# Altium schematic sheet S7CAS-PLEIADES-CARTE-MERE_P02_MOTOR_CTRL.SchDoc
size Tabloid; DocumentNumber: 9; SheetNumber: 9; SheetTotal: 14; Size: 11x17; Sheet_Name: Control du Moteur
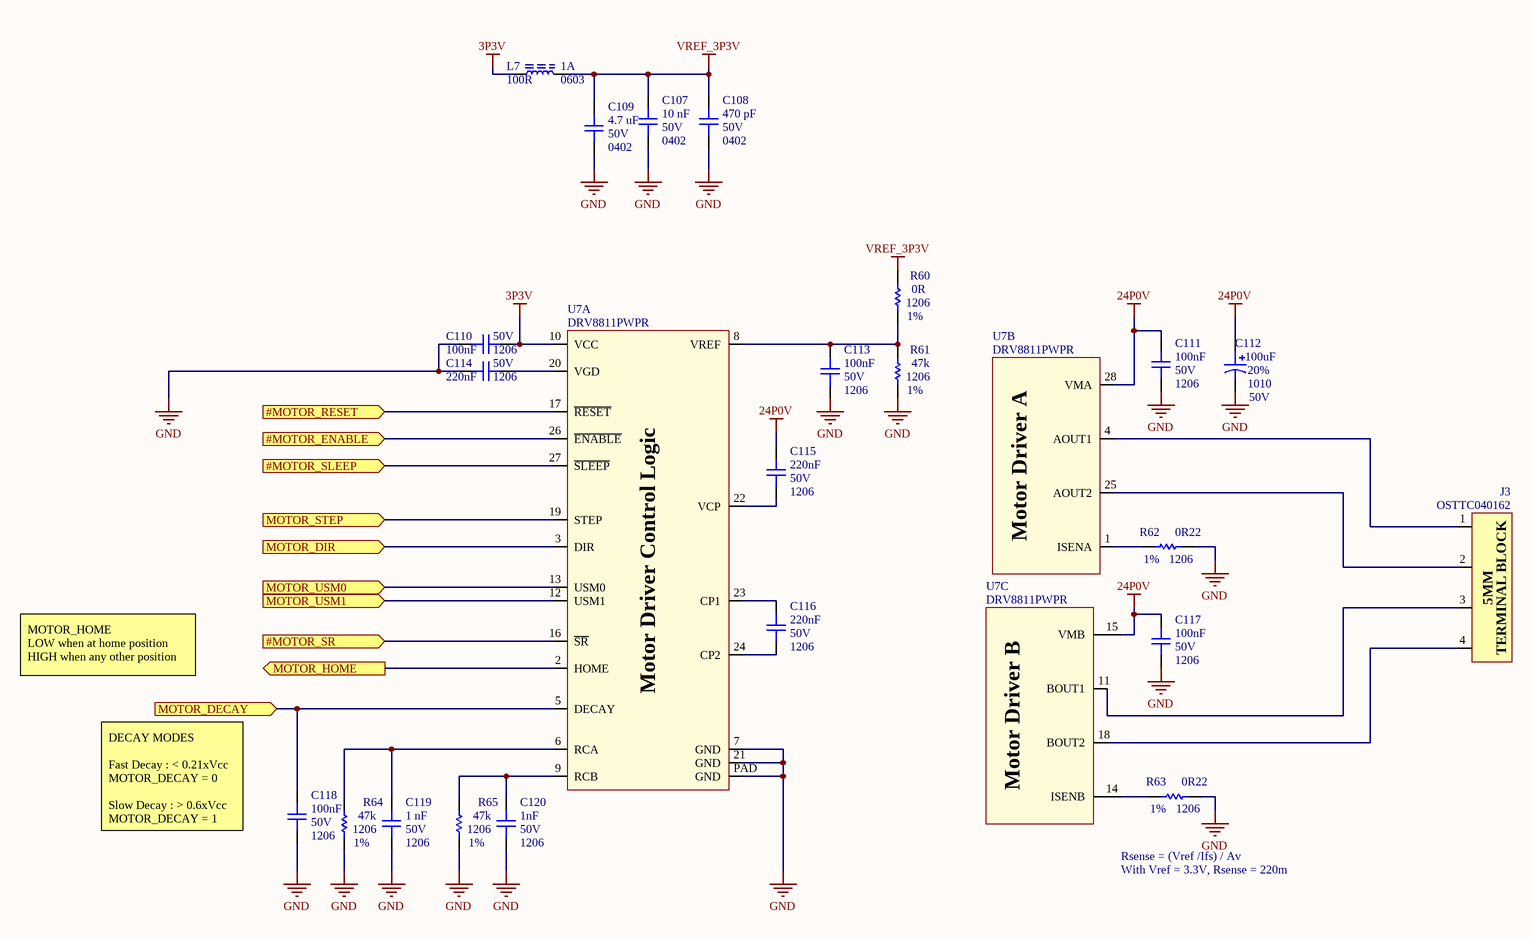
[diagram p0: S7CAS-PLEIADES-CARTE-MERE_P02_MOTOR_CTRL.SchDoc]

## Parts
C107  value 10 nF  Voltage: 50V  Package: 0402  [CAP_0402]  (hidden comment: CAP - 0402)
C108  value 470 pF  Voltage: 50V  Package: 0402  [CAP_0402]  (hidden comment: CAP - 0402)
C109  value 4.7 uF  Voltage: 50V  Package: 0402  [CAP_0402]  (hidden comment: CAP - 0402)
C110  value 100nF  Voltage: 50V  Package: 1206  [CAP_1206]  (hidden comment: CAP - 1206)
C111  value 100nF  Voltage: 50V  Package: 1206  [CAP_1206]  (hidden comment: CAP - 1206)
C112  value 100uF  Voltage: 50V  Package: 1010  Precision: 20%  [CAP_ALU_1010_vishay]  (hidden comment: MAL215099101E3)
C113  value 100nF  Voltage: 50V  Package: 1206  [CAP_1206]  (hidden comment: CAP - 1206)
C114  value 220nF  Voltage: 50V  Package: 1206  [CAP_1206]  (hidden comment: CAP - 1206)
C115  value 220nF  Voltage: 50V  Package: 1206  [CAP_1206]  (hidden comment: CAP - 1206)
C116  value 220nF  Voltage: 50V  Package: 1206  [CAP_1206]  (hidden comment: CAP - 1206)
C117  value 100nF  Voltage: 50V  Package: 1206  [CAP_1206]  (hidden comment: CAP - 1206)
C118  value 100nF  Voltage: 50V  Package: 1206  [CAP_1206]  (hidden comment: CAP - 1206)
C119  value 1 nF  Voltage: 50V  Package: 1206  [CAP_1206]  (hidden comment: CAP - 1206)
C120  value 1nF  Voltage: 50V  Package: 1206  [CAP_1206]  (hidden comment: CAP - 1206)
J3  OSTTC040162  [CONN_TERMINAL_OSTTA040161]
L7  value 100R  Current: 1A  Package: 0603  [FER_0603]  (hidden comment: FER - 0603)
R60  value 0R  Package: 1206  Precision: 1%  [RES_0402]  (hidden comment: RES - 0402)
R61  value 47k  Package: 1206  Precision: 1%  [RES_0402]  (hidden comment: RES - 0402)
R62  value 0R22  Package: 1206  Precision: 1%  [RES_0402]  (hidden comment: RES - 0402)
R63  value 0R22  Package: 1206  Precision: 1%  [RES_0402]  (hidden comment: RES - 0402)
R64  value 47k  Package: 1206  Precision: 1%  [RES_0402]  (hidden comment: RES - 0402)
R65  value 47k  Package: 1206  Precision: 1%  [RES_0402]  (hidden comment: RES - 0402)
U7  DRV8811PWPR  [POW_MOTOR_DRV8811PWPR]  (parts A,B,C of 3)

## Ports
#MOTOR_ENABLE (in), #MOTOR_RESET (in), #MOTOR_SLEEP (in), #MOTOR_SR (in), MOTOR_DECAY (in), MOTOR_DIR (in), MOTOR_HOME (out), MOTOR_STEP (in), MOTOR_USM0 (in), MOTOR_USM1 (in)

## Nets
3P3V: C110.1 L7.2 U7.10(VCC)
24P0V: C111.2 C112.1 C115.2 C117.2 U7.15(VMB) U7.28(VMA)
GND: C107.1 C108.1 C109.1 C110.2 C111.1 C112.2 C113.1 C114.2 C117.1 C118.1 C119.1 C120.1 R61.2 R62.1 R63.1 R64.2 R65.2 U7.7(GND) U7.21(GND) U7.PAD(GND)
VREF_3P3V: C107.2 C108.2 C109.2 L7.1 R60.1
#MOTOR_ENABLE: U7.26(~{ENABLE}) ; port #MOTOR_ENABLE
#MOTOR_RESET: U7.17(~{RESET}) ; port #MOTOR_RESET
#MOTOR_SLEEP: U7.27(~{SLEEP}) ; port #MOTOR_SLEEP
#MOTOR_SR: U7.16(~{SR}) ; port #MOTOR_SR
MOTOR_DECAY: C118.2 U7.5(DECAY) ; port MOTOR_DECAY
MOTOR_DIR: U7.3(DIR) ; port MOTOR_DIR
MOTOR_HOME: U7.2(HOME) ; port MOTOR_HOME
MOTOR_STEP: U7.19(STEP) ; port MOTOR_STEP
MOTOR_USM0: U7.13(USM0) ; port MOTOR_USM0
MOTOR_USM1: U7.12(USM1) ; port MOTOR_USM1
NetC113_2: C113.2 R60.2 R61.1 U7.8(VREF)
NetC114_1: C114.1 U7.20(VGD)
NetC115_1: C115.1 U7.22(VCP)
NetC116_1: C116.1 U7.24(CP2)
NetC116_2: C116.2 U7.23(CP1)
NetC119_2: C119.2 R64.1 U7.6(RCA)
NetC120_2: C120.2 R65.1 U7.9(RCB)
NetJ3_1: J3.1 U7.4(AOUT1)
NetJ3_2: J3.2 U7.25(AOUT2)
NetJ3_3: J3.3 U7.11(BOUT1)
NetJ3_4: J3.4 U7.18(BOUT2)
NetR62_2: R62.2 U7.1(ISENA)
NetR63_2: R63.2 U7.14(ISENB)

## Notes on the sheet
- MOTOR_HOME
  LOW when at home position
  HIGH when any other position
- DECAY MODES
  Fast Decay : < 0.21xVcc
  MOTOR_DECAY = 0
  Slow Decay : > 0.6xVcc
  MOTOR_DECAY = 1
- Rsense = (Vref /Ifs) / Av
- With Vref = 3.3V, Rsense = 220m
- Sheet Name
- Project Title
- Global Project
- Size
- Group
- Revision
- Date
- Sheet
- of
- Filename
- Designers
- (in symbol CONN_TERMINAL_OSTTC040162) 5MM; TERMINAL BLOCK
- (in symbol POW_MOTOR_DRV8811PWPR, part A) Motor Driver Control Logic
- (in symbol POW_MOTOR_DRV8811PWPR, part B) Motor Driver A
- (in symbol POW_MOTOR_DRV8811PWPR, part C) Motor Driver B

## Library data of the parts
C107-C109 = CAP - 0402: Precision: 10%; Current: *; CreatedBy: Jonathan Bouchard; Power: *
C110 C111 C113-C120 = CAP - 1206: Precision: 10%; Current: *; CreatedBy: Jonathan Bouchard; Power: *
C112 = CAP_ALU_MAL215099101E3: CAP - ALU 100uF 20% 50V - 1010; Current: 490mA; Mfg: Vishay Dale; Mfg Part Number: MAL215099101E3; HelpURL: http://www.vishay.com/docs/28395/150crz.pdf; CreatedBy: Jonathan Bouchard; Temperature: -55°C to 125°C; Power: *; Supplier 1: Digikey; Supplier Part Number 1: 4399PHDKR-ND
J3 = CONN_TERMINAL_OSTTC040162: CONN -  TERMINAL BLOCK 4POS 5MM - TH; Mfg: On Shore Technology Inc.; Voltage: *; Current: *; Power: *; Mfg Part Number: OSTTC040162; HelpURL: http://www.on-shore.com/wp-content/uploads/2015/09/osttcxx0162.pdf; CreatedBy: Jonathan Bouchard; Temperature: -30°C ~ 105°C; Value: *; Precision: *; Package: TH-4; Supplier 1: Digikey; Supplier Part Number 1: ED2602-ND
R60-R65 = RES - 0402: Voltage: 50V; Power: 1/16W; Current: *; CreatedBy: Jonathan Bouchard
U7 = POW_MOTOR_DRV8811PWPR: POW - STEPPER MOTOR DRIVER - SOP-28; Voltage: 3 V ~ 5.5 V / 8 V ~ 38 V; Mfg: Texas Instrument; Current: *; Power: *; Mfg Part Number: DRV8811PWPR; HelpURL: http://www.ti.com/lit/ds/symlink/drv8811.pdf; CreatedBy: Jonathan Bouchard; Temperature: -40°C ~ 150°C (TJ); Value: *; Precision: *; Package: SOP-28; Supplier 1: Digikey; Supplier Part Number 1: 296-24591-1-ND
L7 = FER - 0603: Voltage: *; CreatedBy: Jonathan Bouchard; Power: *; Precision: *